# EAGLE design System Buttons (EAGLE 6.5.0)
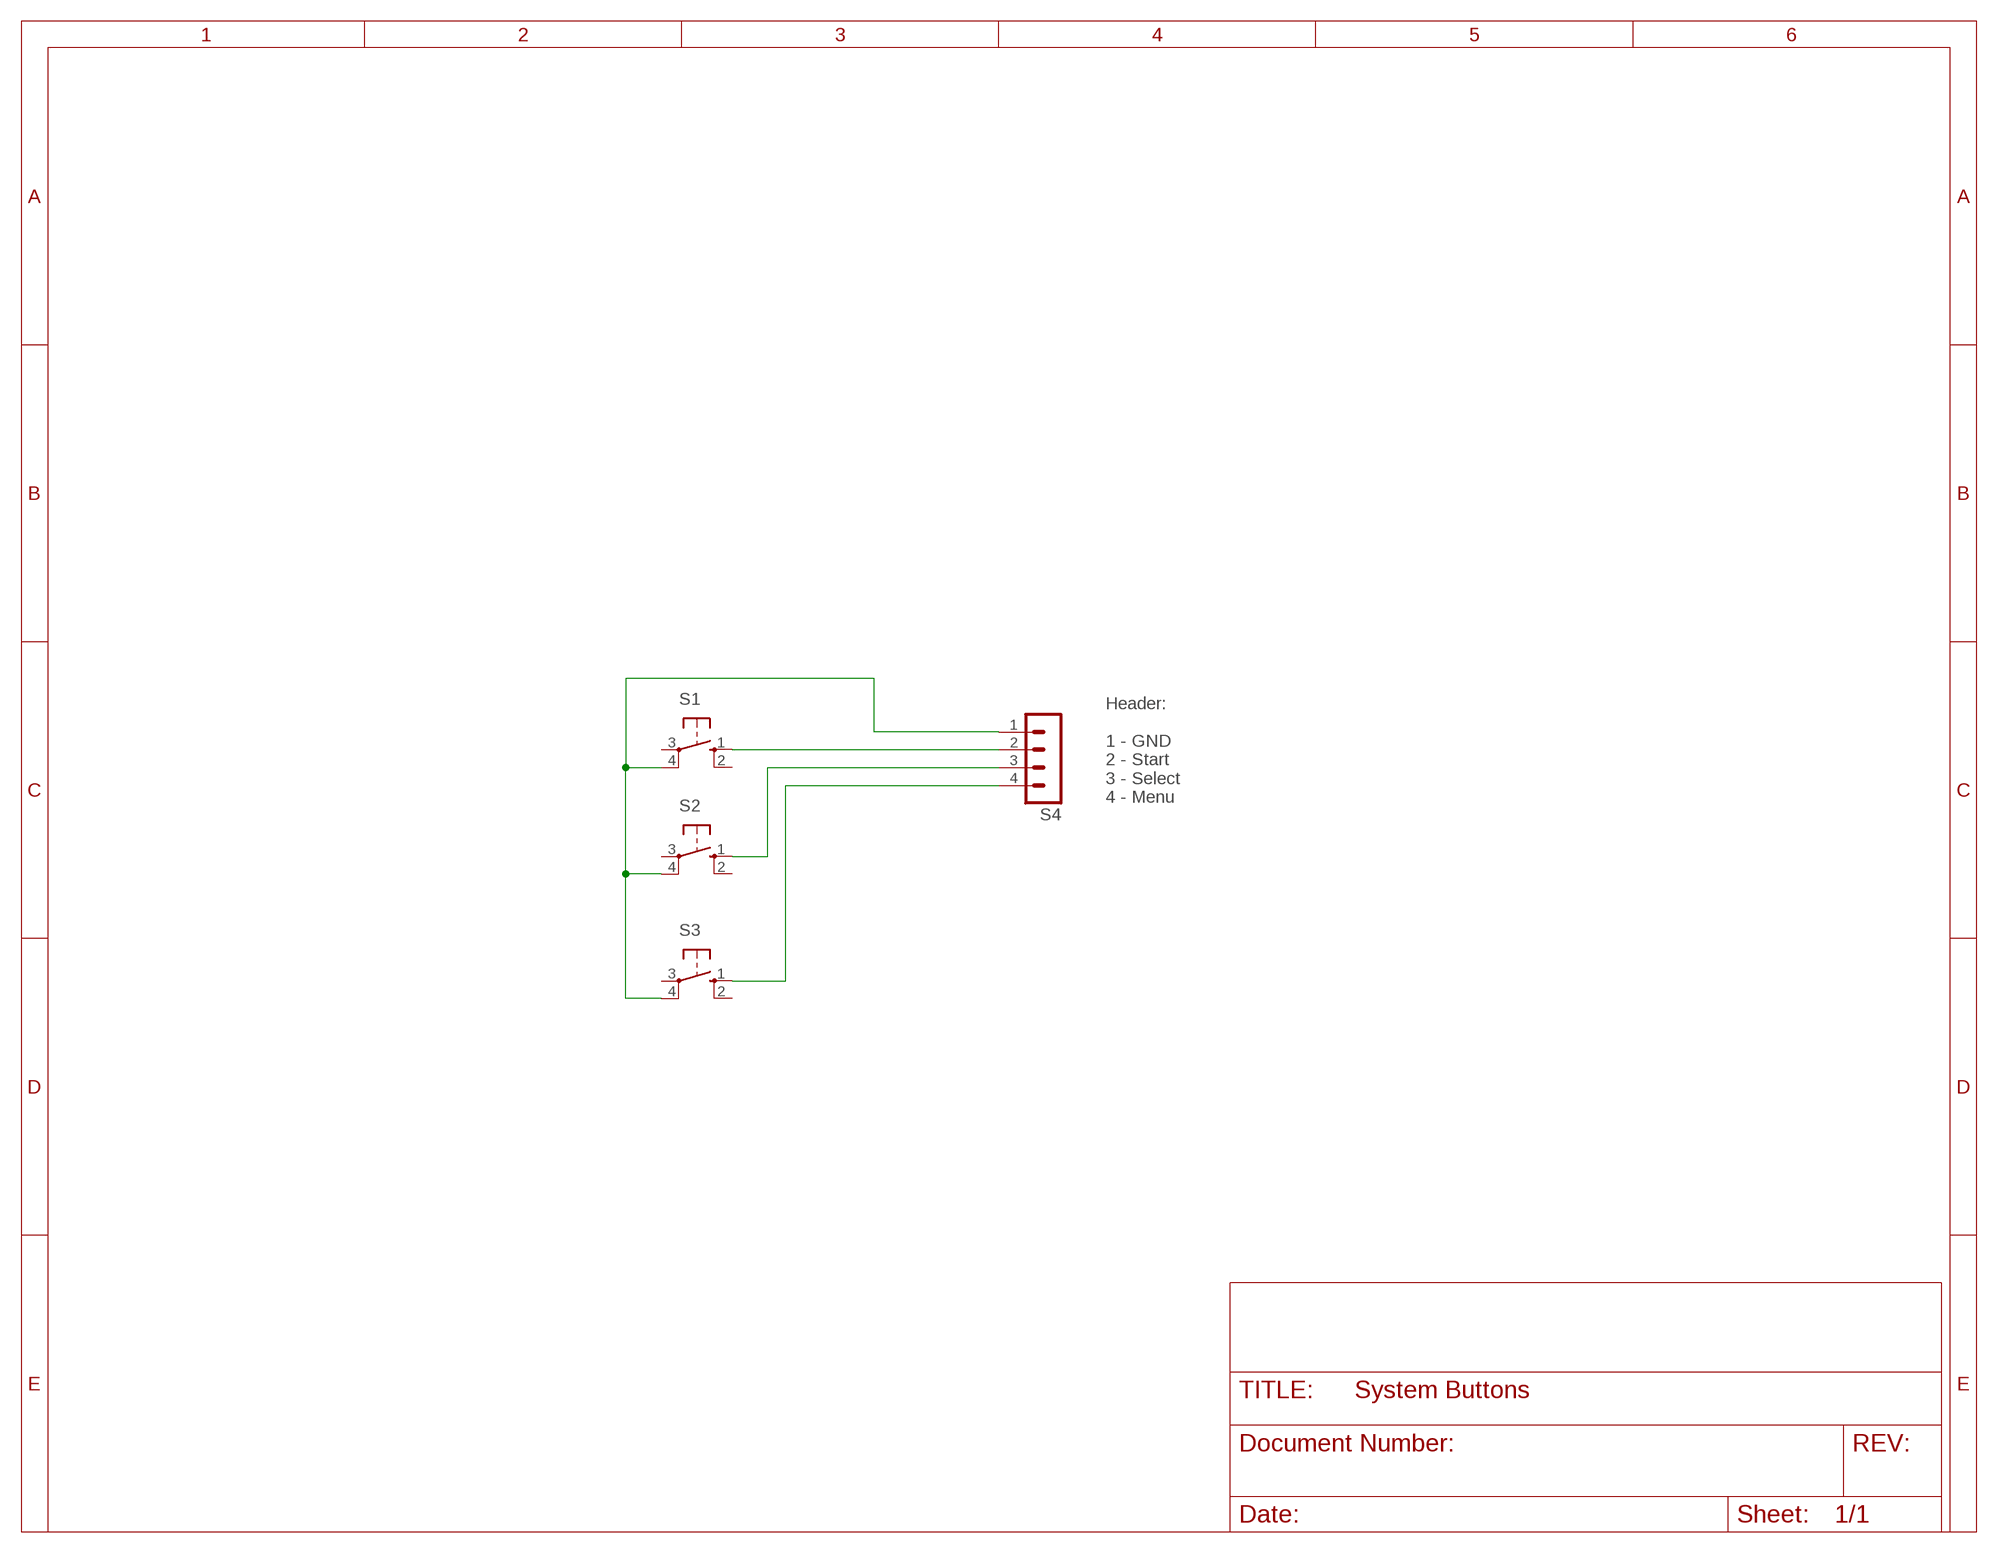
[diagram p0: schematic, sheet 1]

## Parts
S1  10-XX  [B3F-10XX]
S2  10-XX  [B3F-10XX]
S3  10-XX  [B3F-10XX]
S4  MA04-1  [MA04-1]

## Nets
N$1: S1.4(P1) S2.4(P1) S3.4(P1) S4.1
N$2: S1.1(S) S4.2
N$3: S2.1(S) S4.3
N$4: S3.1(S) S4.4
Unconnected: S1.2(S1) S1.3(P) S2.2(S1) S2.3(P) S3.2(S1) S3.3(P)

## Notes on the sheet
- Header:
  
  1 - GND
  2 - Start
  3 - Select
  4 - Menu

## Library data of the parts
S1-S3 = switch-omron:10-XX: OMRON SWITCH; MPN: B3F-1000; OC_FARNELL: 176432; OC_NEWARK: 36M3542
S4 = con-lstb:MA04-1: PIN HEADER; OC_FARNELL: unknown; OC_NEWARK: unknown

## Board
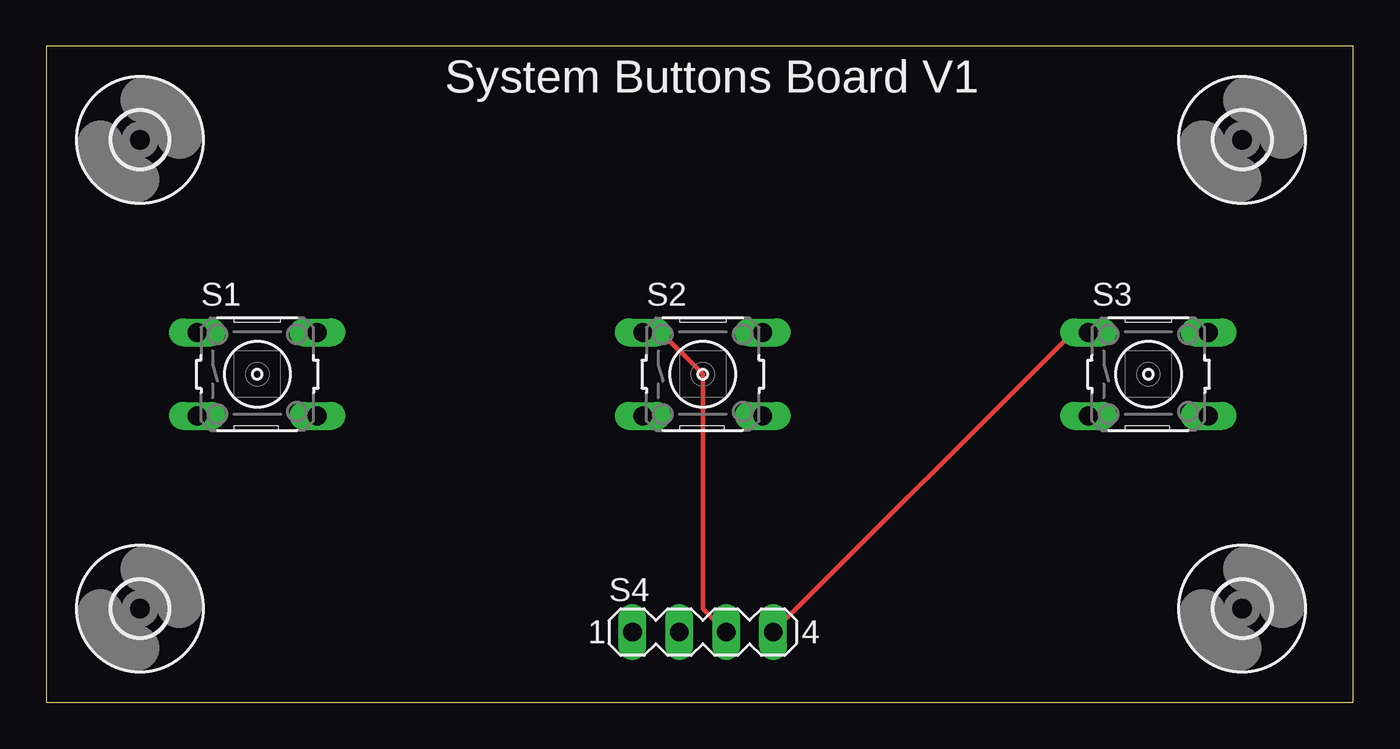
[diagram p1: board, top side]
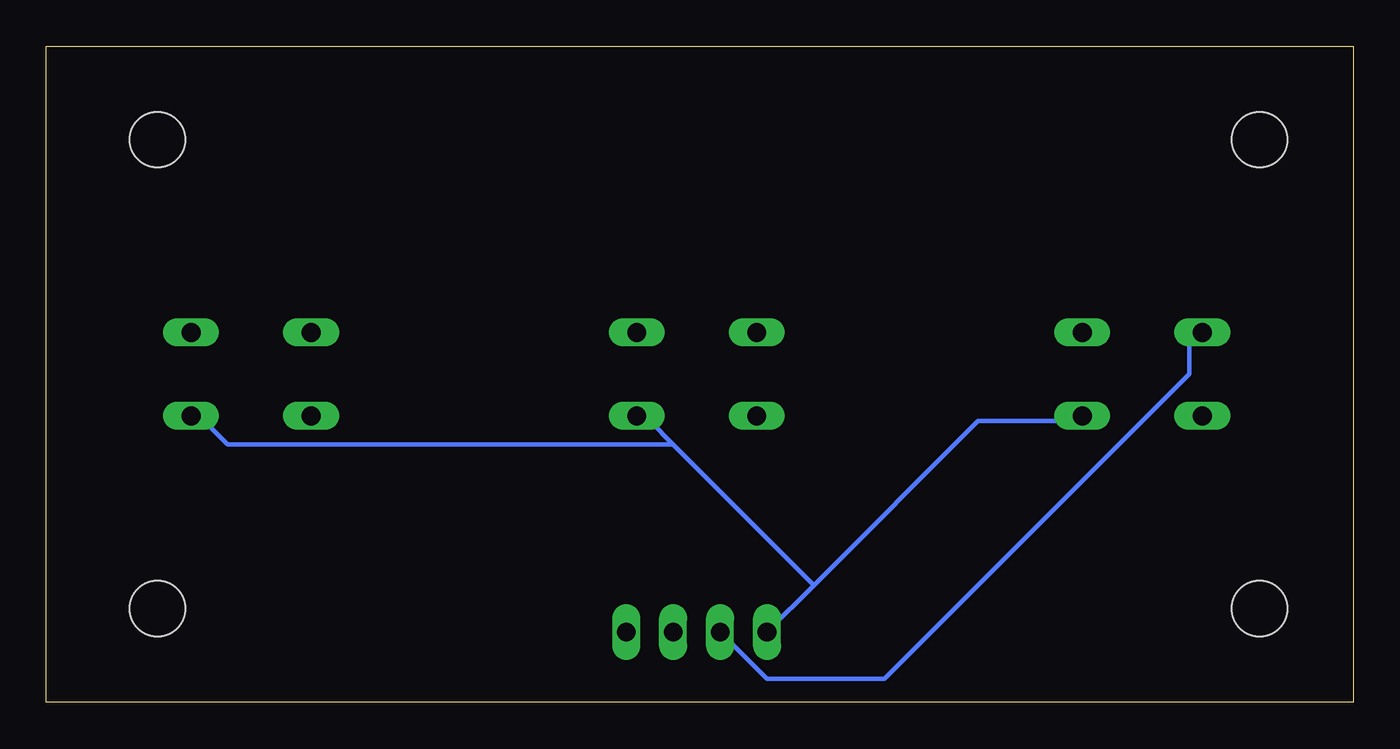
[diagram p2: board, bottom side, seen from below]

Size 70.79 x 35.55 mm. Coordinates in mm from the lower left corner, seen from the top.
Outline: 0,0 70.79,0 70.79,35.55 0,35.55 0,0
Copper layers (1*16): Top 0.035mm / dielectric 1.5mm / Bottom 0.035mm
Design rules "default": minimum track width 10mil, minimum drill 24mil, track to track 8mil, track to pad 8mil, pad to pad 8mil, via to via 8mil, smd to smd 8mil, copper to edge 40mil, drill to drill 8mil, minimum pad ring 10mil, minimum via ring 8mil, stop-mask expansion 4mil, vias tented up to drill 0mil, thermal gap 10mil

### Footprints (pad centres in the part's own frame; a part is rotated, then mirrored left to right if it is on the bottom)
B3F-10XX = drill 1.016 long: 1 -3.251,2.261; 2 3.251,2.261; 3 -3.251,-2.261; 4 3.251,-2.261
MA04-1 = drill 1.016 long: 1 -3.81,0; 2 -1.27,0; 3 1.27,0; 4 3.81,0
3,0 = hole 3: 0,0

### Placement (x,y rotation side)
S1  11.43,17.78 0 top
S2  35.56,17.78 0 top
S3  59.69,17.78 0 top
S4  35.56,3.81 0 top
U$1  [3,0]  5.08,5.08 0 top
U$2  [3,0]  64.77,5.08 0 top
U$3  [3,0]  5.08,30.48 0 top
U$4  [3,0]  64.77,30.48 0 top

### Tracks (layer width: path | path; a pad name or v marks a point on that pad's centre or on a via)
N$1
  Bottom 0.254: 29.21,6.35 20.32,15.24 15.24,15.24 S1.4 | 29.21,6.35 S4.1 | 29.21,6.35 36.83,13.97 | 36.83,13.97 38.1,15.24 S2.4 | 36.83,13.97 60.96,13.97 62.23,15.24 S3.4
N$2
  Bottom 0.254: S4.2 31.75,1.27 25.4,1.27 8.89,17.78 8.89,20.32 S1.1
N$3
  Top 0.254: S4.3 35.56,5.08 35.56,17.78 33.02,20.32 S2.1
N$4
  Top 0.254: S4.4 55.88,20.32 S3.1

### Text on the board
tNames: System Buttons Board V1